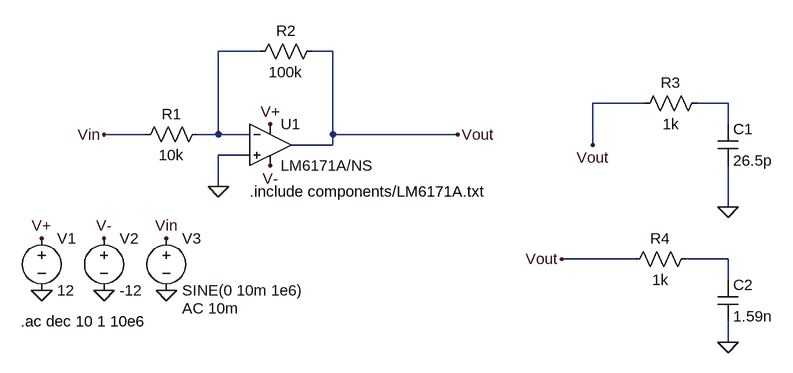
[diagram p0: schematic stage-5-LM6171A-post-inverting-op-amp.asc]
stage-5-LM6171A-post-inverting-op-amp.asc, the LTspice schematic file:
Version 4
SHEET 1 972 680
WIRE 176 32 112 32
WIRE 288 32 256 32
WIRE 768 112 688 112
WIRE 896 112 848 112
WIRE 896 144 896 112
WIRE 0 160 -64 160
WIRE 112 160 112 32
WIRE 112 160 80 160
WIRE 160 160 112 160
WIRE 288 160 288 32
WIRE 480 160 288 160
WIRE 288 176 288 160
WIRE 288 176 224 176
WIRE 688 176 688 112
WIRE 160 192 112 192
WIRE 112 240 112 192
WIRE 896 272 896 208
WIRE 752 352 640 352
WIRE 896 352 832 352
WIRE 896 384 896 352
WIRE 896 480 896 448
FLAG 192 144 V+
FLAG -160 320 V+
FLAG -160 400 0
FLAG -64 400 0
FLAG 32 400 0
FLAG 192 208 V-
FLAG -64 320 V-
FLAG 112 240 0
FLAG -64 160 Vin
FLAG 32 320 Vin
FLAG 896 272 0
FLAG 480 160 Vout
FLAG 688 176 Vout
FLAG 640 352 Vout
FLAG 896 480 0
SYMBOL OpAmps\\opamp2 192 112 R0
SYMATTR InstName U1
SYMATTR Value LM6171A/NS
SYMBOL voltage -160 304 R0
WINDOW 123 0 0 Left 0
WINDOW 39 0 0 Left 0
SYMATTR InstName V1
SYMATTR Value 12
SYMBOL voltage -64 304 R0
WINDOW 123 0 0 Left 0
WINDOW 39 0 0 Left 0
SYMATTR InstName V2
SYMATTR Value -12
SYMBOL voltage 32 304 R0
WINDOW 123 24 124 Left 2
WINDOW 39 0 0 Left 0
SYMATTR Value2 AC 10m
SYMATTR InstName V3
SYMATTR Value SINE(0 10m 1e6)
SYMBOL res 96 144 R90
WINDOW 0 0 56 VBottom 2
WINDOW 3 32 56 VTop 2
SYMATTR InstName R1
SYMATTR Value 10k
SYMBOL res 272 16 R90
WINDOW 0 0 56 VBottom 2
WINDOW 3 32 56 VTop 2
SYMATTR InstName R2
SYMATTR Value 100k
SYMBOL cap 880 144 R0
SYMATTR InstName C1
SYMATTR Value 26.5p
SYMBOL res 864 96 R90
WINDOW 0 0 56 VBottom 2
WINDOW 3 32 56 VTop 2
SYMATTR InstName R3
SYMATTR Value 1k
SYMBOL cap 880 384 R0
SYMATTR InstName C2
SYMATTR Value 1.59n
SYMBOL res 848 336 R90
WINDOW 0 0 56 VBottom 2
WINDOW 3 32 56 VTop 2
SYMATTR InstName R4
SYMATTR Value 1k
TEXT 160 248 Left 2 !.include components/LM6171A.txt
TEXT -192 448 Left 2 !.ac dec 10 1 10e6

The netlist it stands for:
* stage-5-LM6171A-post-inverting-op-amp.asc
XU1 0 N001 V+ V- Vout LM6171A/NS  ; pins In+ In- V+ V- OUT
V1 V+ 0 12
V2 V- 0 -12
V3 Vin 0 SINE(0 10m 1e6) AC 10m
R1 N001 Vin 10k
R2 Vout N001 100k
C1 N002 0 26.5p
R3 N002 Vout 1k
C2 N003 0 1.59n
R4 N003 Vout 1k
.include components/LM6171A.txt
.ac dec 10 1 10e6
.backanno
.end